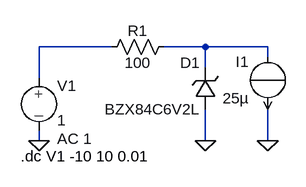
[diagram p0: schematic zener_test.asc]
zener_test.asc, the LTspice schematic file:
Version 4
SHEET 1 880 680
WIRE 48 144 -64 144
WIRE 192 144 128 144
WIRE 288 144 192 144
WIRE 288 160 288 144
WIRE 192 176 192 144
WIRE -64 192 -64 144
WIRE -64 288 -64 272
WIRE 192 288 192 240
WIRE 288 288 288 240
FLAG 288 288 0
FLAG 192 288 0
FLAG -64 288 0
SYMBOL zener 208 240 R180
WINDOW 0 24 72 Left 0
WINDOW 3 24 0 Left 0
SYMATTR InstName D1
SYMATTR Value BZX84C6V2L
SYMATTR Description Diode
SYMATTR Type diode
SYMBOL res 32 160 R270
WINDOW 0 25 56 VTop 0
WINDOW 3 7 56 VBottom 0
SYMATTR InstName R1
SYMATTR Value 100
SYMBOL source-V -64 176 R0
WINDOW 123 28 109 Left 0
WINDOW 39 0 0 Left 0
SYMATTR InstName V1
SYMATTR Value 1
SYMATTR Value2 AC 1
SYMBOL source-I 288 240 R180
WINDOW 0 29 73 Left 0
WINDOW 3 29 17 Left 0
WINDOW 123 0 0 Left 0
WINDOW 39 0 0 Left 0
SYMATTR InstName I1
SYMATTR Value 25µ
TEXT -92 312 Left 0 !.dc V1 -10 10 0.01

The netlist it stands for:
* zener_test.asc
D1 0 N002 BZX84C6V2L
R1 N001 N002 100
V1 N001 0 1 AC 1
I1 N002 0 25µ
.model D D
.lib standard.dio
.dc V1 -10 10 0.01
.backanno
.end